# EAGLE schematic Minimal-Driver (EAGLE 7.6.0)
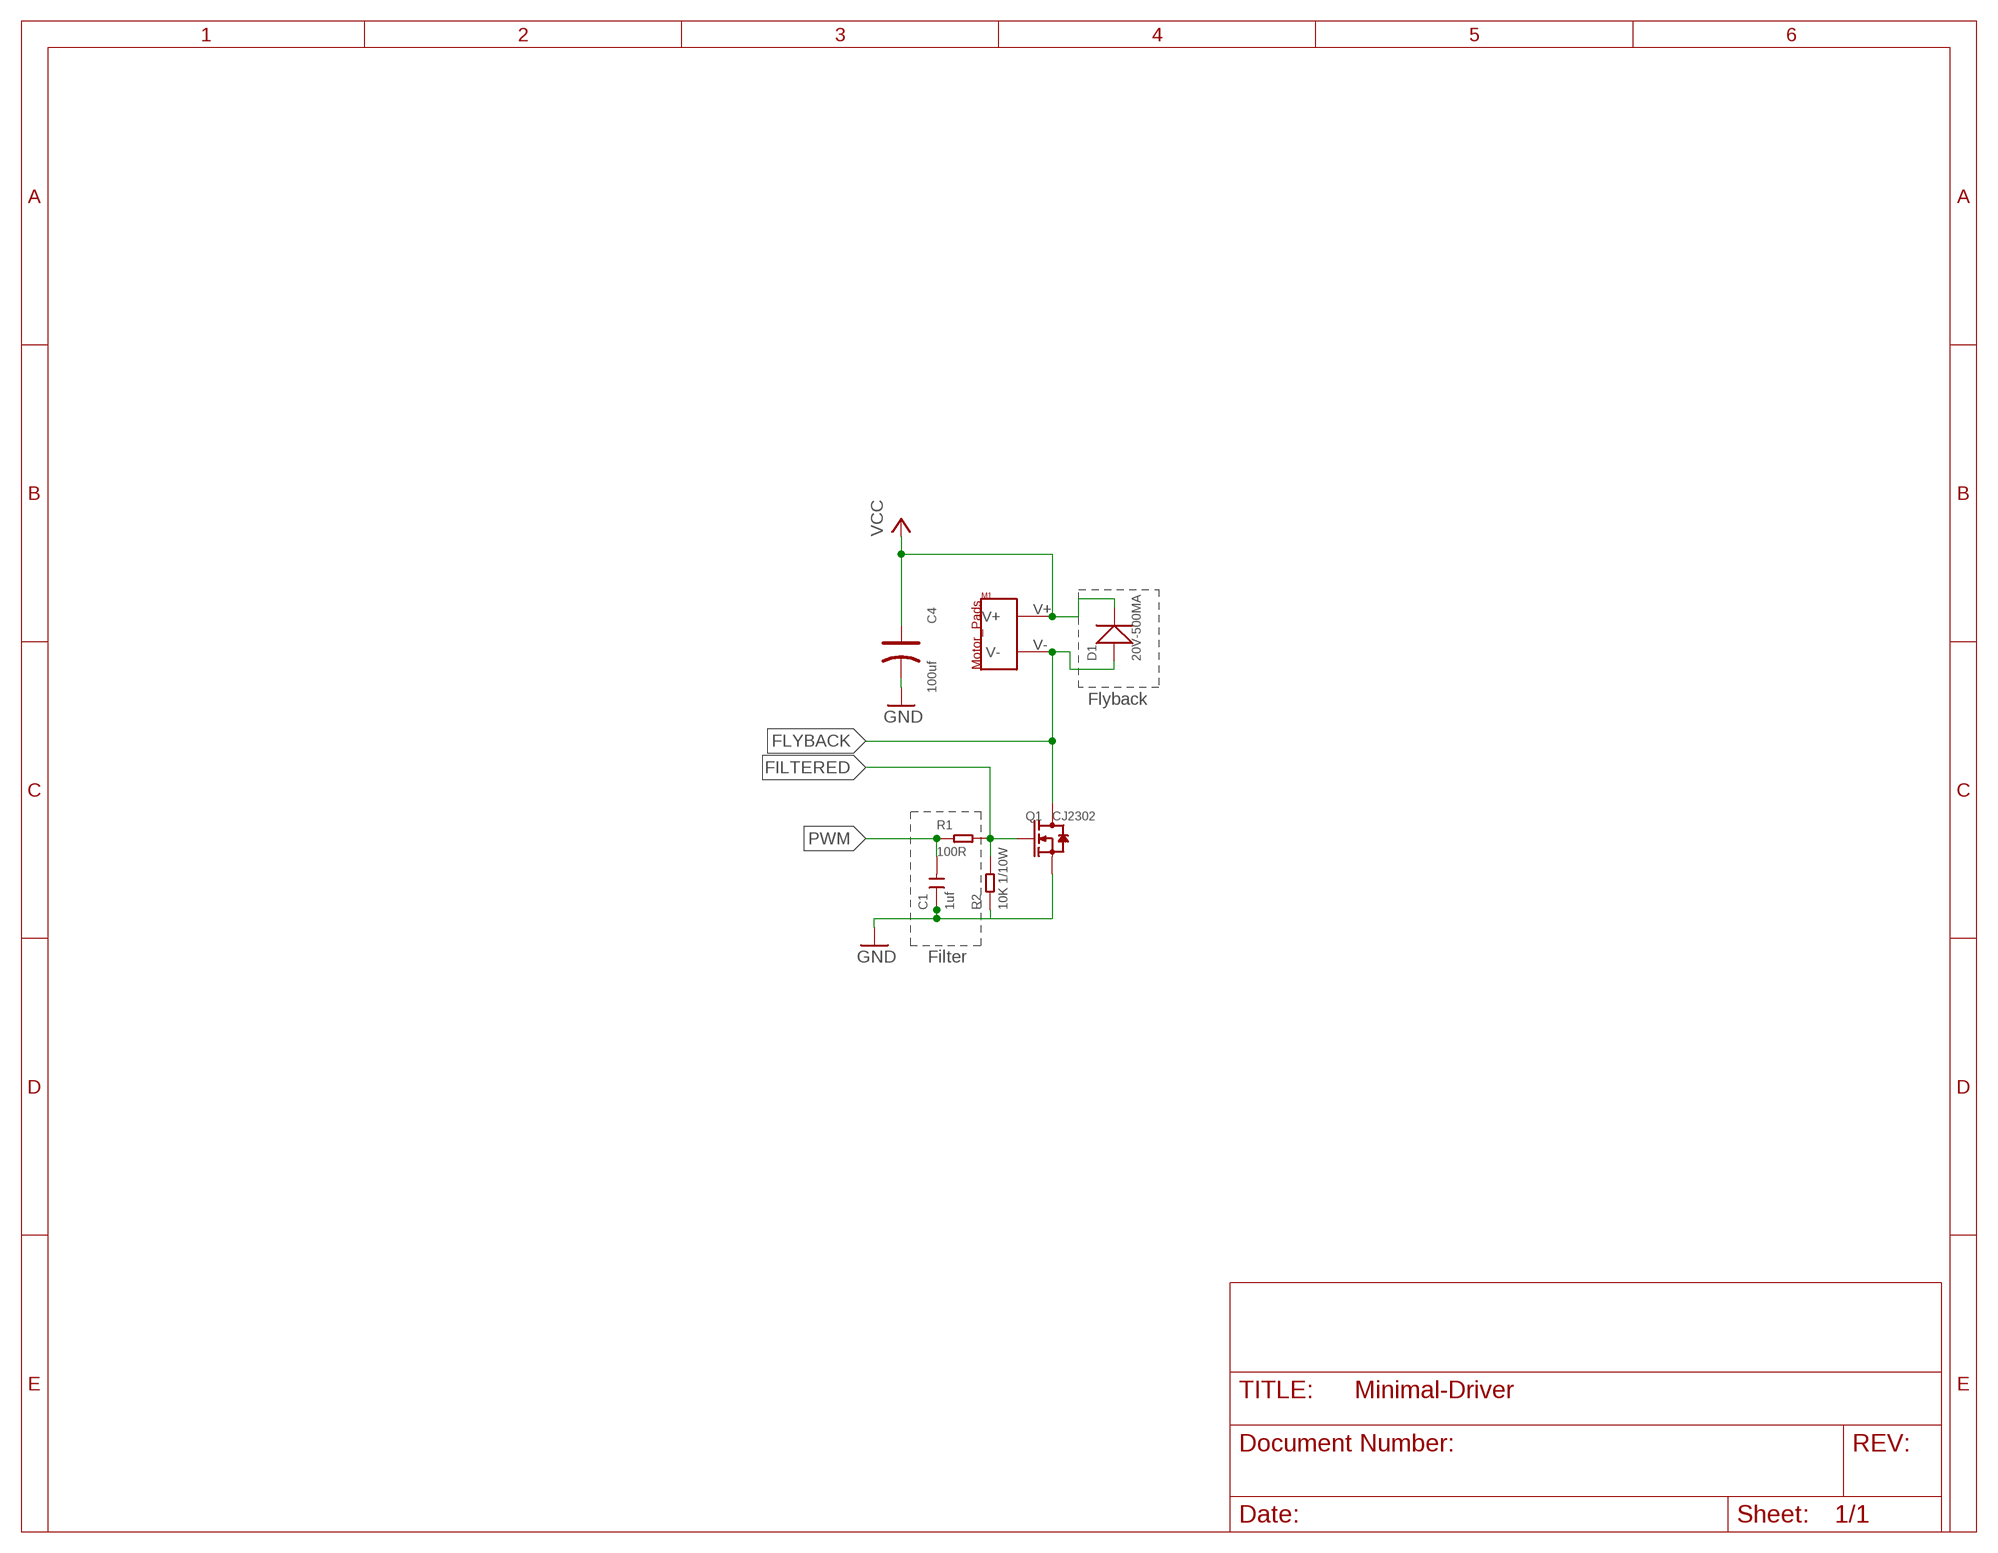
[diagram p0: schematic, sheet 1]

## Parts
C1  1uf  CERAMIC-1UF-10V-10%-X5R(0402)  [C0402]
C4  100uf  TANTALUM-SMD-100UF-10V(AVX-B)  [AVX-B]
D1  20V-500MA  SMD-DIODE-SCHOTTKY-20V-500MA(SOD-123)  [SOD-123]
M1  MOTOR_PADS  [MOTOR_PADS]
Q1  CJ2302  SMD-MOSFET-N-CH-20V-2.1A-CJ2302(SOT-23)  [SOT-23]
R1  100R  SMD-RES-100R-5%-1/10W(0603)  [R0603]
R2  10K 1/10W  SMD-RES-10K-5%-1/10W(0603)  [R0603]

## Nets
FILTERED: Q1.1(G) R1.2 R2.2
FLYBACK [HighAmps]: D1.+ M1.V- Q1.3(D)
GND [HighAmps]: C1.1 C4.- Q1.2(S) R2.1
PWM: C1.2 R1.1
VCC [HighAmps]: C4.+ D1.- M1.V+

## Notes on the sheet
- Flyback
- Filter

## Library data of the parts
C1 = Seeed-Capacitor-2016:CERAMIC-1UF-10V-10%-X5R(0402): 302010040; MPN: CC0402KRX5R6BB105
C4 = Seeed-Capacitor-2016:TANTALUM-SMD-100UF-10V(AVX-B): 302020015; MPN: TAJB107M010#NJ
D1 = Seeed-Diode-2016:SMD-DIODE-SCHOTTKY-20V-500MA(SOD-123): 304020032; MPN: SS0520-7-F
M1 = Andranik-Lab4:MOTOR_PADS
Q1 = Seeed-Transistor-2016:SMD-MOSFET-N-CH-20V-2.1A-CJ2302(SOT-23): 305030015; MPN: CJ2302
R1 = Seeed-Resistor-2016:SMD-RES-100R-5%-1/10W(0603): 301010090; MPN: RC0603JR-07100RL
R2 = Seeed-Resistor-2016:SMD-RES-10K-5%-1/10W(0603): 301010293; MPN: RC0603JR-0710KL

## Net classes
1 HighAmps: width 0.762 mm